# Altium schematic sheet power.SchDoc: Power supplies & sequencing
size A4; Author: Olexandr Gudozhnik; Organization: EPFL-STI-LIS; Address1: EPFL, Station 9; Address2: 1015 Lausanne; Address3: Switzerland; DocumentNumber: 2; SheetNumber: 2; SheetTotal: 8
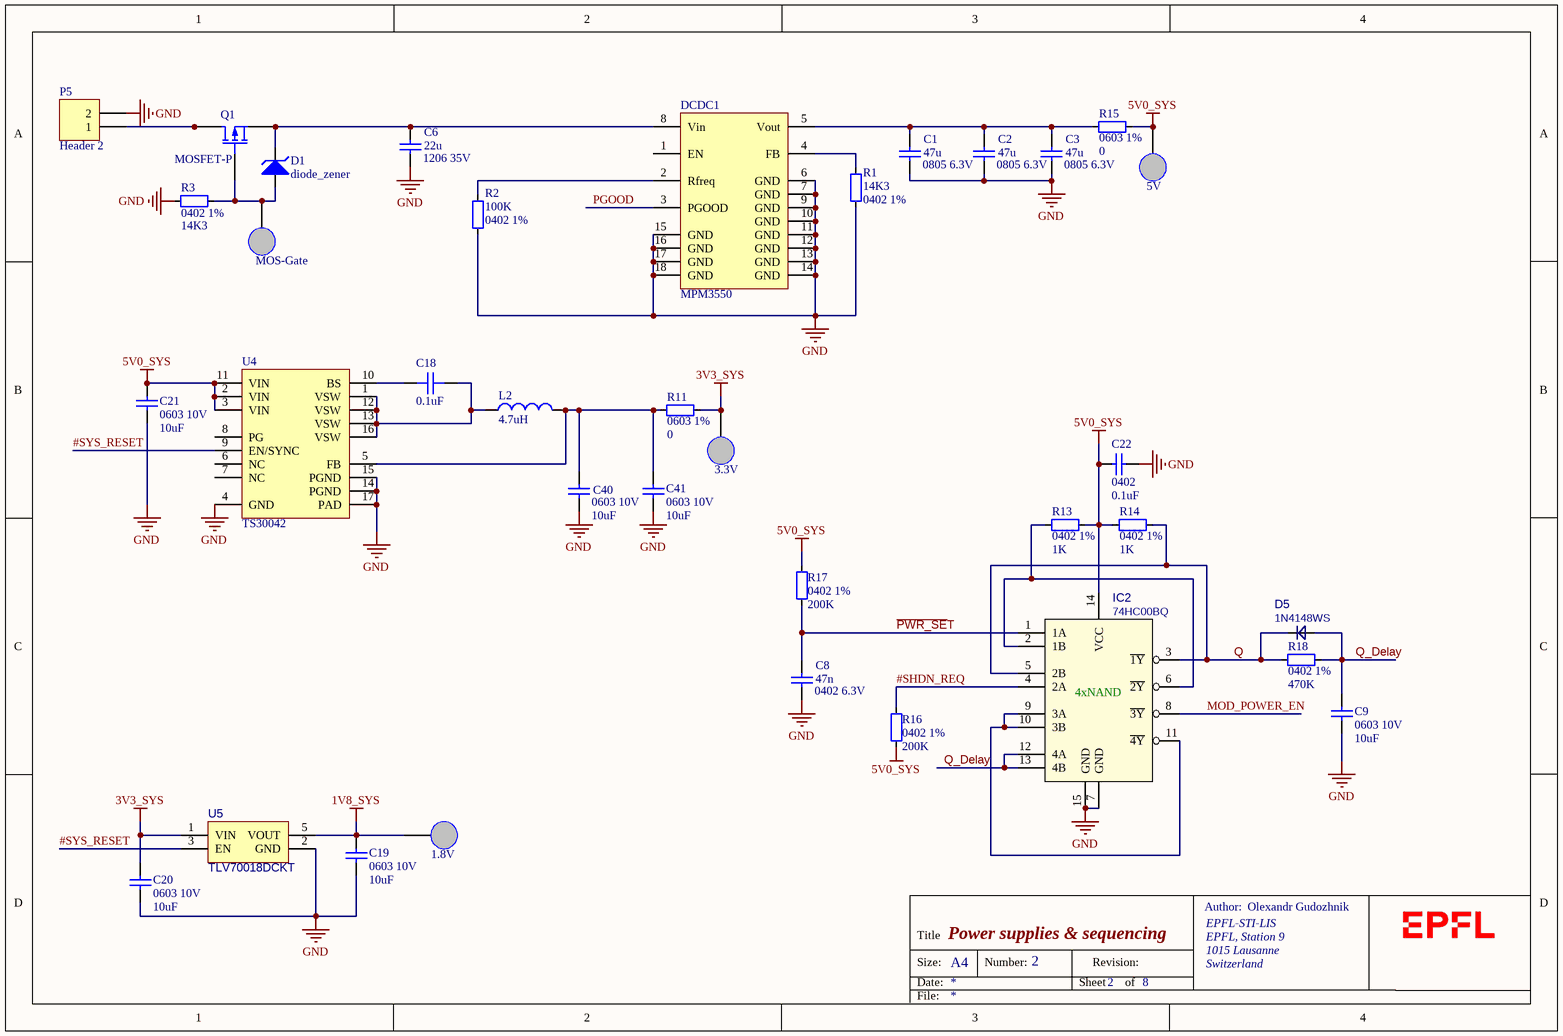
[diagram p0: power.SchDoc]

## Parts
1.8V  TP  [test_point]  (value not drawn)  (no BOM)
3.3V  TP  [test_point]  (value not drawn)  (no BOM)
5V  TP  [test_point]  (value not drawn)  (no BOM)
C1  0805 6.3V  value 47u  [cap0805]
C2  0805 6.3V  value 47u  [cap0805]
C3  0805 6.3V  value 47u  [cap0805]
C6  1206 35V  value 22u  [cap1206]
C8  0402 6.3V  value 47n  [cap0402]
C9  0603 10V  value 10uF  [cap0603]
C18  value 0.1uF  [CAP0603]  (hidden comment: .Value)
C19  0603 10V  value 10uF  [cap0603]
C20  0603 10V  value 10uF  [cap0603]
C21  0603 10V  value 10uF  [cap0603]
C22  0402  value 0.1uF  [cap0402]
C40  0603 10V  value 10uF  [cap0603]
C41  0603 10V  value 10uF  [cap0603]
D1  diode_zener  [sod323]
D5  1N4148WS  [SOD-323]
DCDC1  MPM3550  [MPM3550E]
IC2  74HC00BQ  [DHVQFN14]
L2  value 4.7uH  [NRS5030]  (hidden comment: Inductor)
MOS-Gate  TP  [test_point]  (value not drawn)  (no BOM)
P5  Header 2  [xt30_fem_hor]
Q1  MOSFET-P  [DFN8_5x6]
R1  0402 1%  value 14K3  [res0402]
R2  0402 1%  value 100K  [res0402]
R3  0402 1%  value 14K3  [res0402]
R11  0603 1%  value 0  [res0603]
R13  0402 1%  value 1K  [res0402]
R14  0402 1%  value 1K  [res0402]
R15  0603 1%  value 0  [res0603]
R16  0402 1%  value 200K  [res0402]
R17  0402 1%  value 200K  [res0402]
R18  0402 1%  value 470K  [res0402]
U4  TS30042  [qfn16_TP]
U5  TLV70018DCKT  [SC70-5]

## Nets
1V8_SYS: 1.8V.1(TP) C19.2 U5.5(VOUT)
3V3_SYS: 3.3V.1(TP) C20.2 R11.1 U5.1(VIN)
5V0_SYS: 5V.1(TP) C21.2 C22.2 IC2.14(VCC) R13.1 R14.2 R15.1 R16.2 R17.1 U4.2(VIN) U4.3(VIN) U4.11(VIN)
GND: C1.2 C2.2 C3.2 C6.2 C8.2 C9.1 C19.1 C20.1 C21.1 C22.1 C40.1 C41.1 DCDC1.6(GND) DCDC1.7(GND) DCDC1.9(GND) DCDC1.10(GND) DCDC1.11(GND) DCDC1.12(GND) DCDC1.13(GND) DCDC1.14(GND) DCDC1.15(GND) DCDC1.16(GND) DCDC1.17(GND) DCDC1.18(GND) IC2.7(GND) IC2.15(GND) P5.2 R1.1 R2.1 R3.2 U4.4(GND) U4.14(PGND) U4.15(PGND) U4.17(PAD) U5.2(GND)
#SHDN_REQ: IC2.4(2A) R16.1
#SYS_RESET: U4.9(EN/SYNC) U5.3(EN)
~{PWR_SE}T: C8.1 IC2.1(1A) R17.2
MOD_POWER_EN: IC2.8(~{3Y})
PGOOD: DCDC1.3(PGOOD)
Q: D5.C IC2.3(~{1Y}) IC2.5(2B) R14.1 R18.2
Q_Delay: C9.2 D5.A IC2.12(4A) IC2.13(4B) R18.1
NetC1_1: C1.1 C2.1 C3.1 DCDC1.5(Vout) R15.2
NetC6_1: C6.1 D1.2(K) DCDC1.8(Vin) Q1.1(S) Q1.2(S) Q1.3(S)
NetC18_1: C18.1 U4.10(BS)
NetC18_2: C18.2 L2.1 U4.1(VSW) U4.12(VSW) U4.13(VSW) U4.16(VSW)
NetC40_2: C40.2 C41.2 L2.2 R11.2 U4.5(FB)
NetD1_1: D1.1(A) MOS-Gate.1(TP) Q1.4(G) R3.1
NetDCDC1_2: DCDC1.2(Rfreq) R2.2
NetDCDC1_4: DCDC1.4(FB) R1.2
NetIC2_2: IC2.2(1B) IC2.6(~{2Y}) R13.2
NetIC2_9: IC2.9(3A) IC2.10(3B) IC2.11(~{4Y})
NetP5_1: P5.1 Q1.5(D) Q1.6(D) Q1.7(D) Q1.8(D)

Not connected (* = marked no-connect by the designer): DCDC1 1(EN); U4 6(NC) 7(NC) 8(PG)

## Notes on the sheet
- Author:
- Title
- Size:
- Date:
- A4
- Number:
- Sheet
- Revision:
- of
- File:
- (in symbol 74HC00BQ) 4xNAND

## Library data of the parts
1.8V 3.3V 5V MOS-Gate = TP: Test point
C1-C3 C6 C8 = cap_no_param: Supplier 1: Digi-Key
  C1-C3: Supplier Part Number 1: 587-4280-1-ND
  C6: Supplier Part Number 1: 445-8045-1-ND
  C8: Supplier Part Number 1: 490-6335-1-ND
C9 C19-C22 C40 C41 = cap: standard, non-polarized capacitor; Supplier 1: Digi-Key; Footprint verified: no
  C9 C19-C21 C40 C41: Supplier Part Number 1: 490-10474-1-ND; Supplier Price 1: 0.23
  C22: Supplier Part Number 1: 490-14603-1-ND; Supplier Price 1: 0.08
C18 = capacitor_smd_0603_25V: Ceramic capacitor, SMD, 0603, 25V, 10%, X7R; PackageReference: RAD-0.3; PackageDescription: Radial Cap, Thru-Hole; 2 Leads; 0.3 in Pin Spacing; Digikey Unit Price: 0.08; Supplier 1: Digi-Key; Supplier Part Number 1: 490-6051-1-ND
D1 = diode_zener: Zener diode; Published: 8-Jun-2000; LatestRevisionDate: 17-Jul-2002; LatestRevisionNote: Re-released for DXP Platform.; PackageReference: DIODE-0.7; Publisher: Altium Limited; PackageDescription: Diode, Thru-Hole; 2 Leads; 0.7 in Pin Spacing; Supplier 1: Digi-Key; Supplier Part Number 1: MMSZ5240BS-FDICT-ND
D5 = diode: Diode small signal; Manufacturer: ON SEMICONDUCTOR; PartNumber: 1N4148WS; Value: 1N4148WS; PartSymbol: 1N4148WS; Supplier 1: Digi-Key; Supplier Part Number 1: 1N4148WSFSCT-ND
IC2 = 74HC00BQ: 2 NAND Gate, 4 channel; Manufacturer: NEXPERIA; PartNumber: 74HC00BQ; Value: 74HC00BQ; PartSymbol: 74HC00BQ; Supplier 1: Digi-Key; Supplier Part Number 1: 1727-3213-1-ND
L2 = Inductor: Code_IEC: 1005; PackageReference: 0402-A; PackageDescription: Chip Inductor; Code_JEITA: 0402; dIGIKEY rEF: 445-2182-1-ND; Supplier 1: Digi-Key; Supplier Part Number 1: 587-3605-1-ND
P5 = Header 2: Header, 2-Pin; LatestRevisionDate: 17-Jul-2002; LatestRevisionNote: Re-released for DXP Platform.; Publisher: Altium Limited
Q1 = pmos_dfn8: P-Channel MOSFET in DFN8 package (DFN5); Published: 8-Jun-2000; LatestRevisionDate: 17-Jul-2002; LatestRevisionNote: Re-released for DXP Platform.; PackageVersion: 1995/1996; PackageReference: E3; Publisher: Altium Limited; PackageDescription: TO, Flat Index; 3 In-Line, Axial Leads; Body Dia. 4.6mm; Lead Dia. 0.5 mm (max); Supplier 1: Digi-Key; Supplier Part Number 1: FDWS9508L-F085OSCT-ND
R1 R3 = res: Supplier 1: Digi-Key; Supplier Part Number 1: P14.3KLCT-ND
R2 R11 R13-R18 = res: 100K; Supplier 1: Digi-Key
  R2: Supplier Part Number 1: P100KLCT-ND
  R11 R15: Supplier Part Number 1: 311-0.0GRCT-ND
  R13 R14: Supplier Part Number 1: P1.00KLCT-ND
  R16 R17: Supplier Part Number 1: P200KLCT-ND
  R18: Supplier Part Number 1: P470KLCT-ND
U4 = TS30042: 40V,2A  synch voltage reg, QFN16 3x3mm; Manufacturer: National Semiconductor; PackageTopMarking: NS*UZXYTT*S0003LB; CompType: Switcher; PowerWise: N; PackageReference: SRC14A; RevisionNote: Component URLs added; PackageVersion: revA, Jul-2003; PackageDescription: LLP, Plastic, Dual, 6 x 5 x 1mm Body, 14 Lead, 0.8mm Pitch, No Pullback; PinCount: 14; Digikey Ref: LM2676SD-12/NOPBCT-ND; Footprint verified: no; Supplier 1: Digi-Key; Supplier Part Number 1: TS30042-M033QFNRCT-ND
U5 = TLV700: Voltage Regulator, 2V to 5.5V, 175mV Dropout, 1.8Vout, 200mAout; Manufacturer: TEXAS INSTRUMENTS; Value: TLV70018DCKT; PartNumber: TLV70018DCKT; PartSymbol: TLV70018DCKT; Supplier 1: Digi-Key; Supplier Part Number 1: 296-25269-1-ND
DCDC1 = MPM3550: Supplier 1: Digi-Key; Supplier Part Number 1: 1589-2043-ND